# Altium project Dashboard PCB_Project.PrjPcb
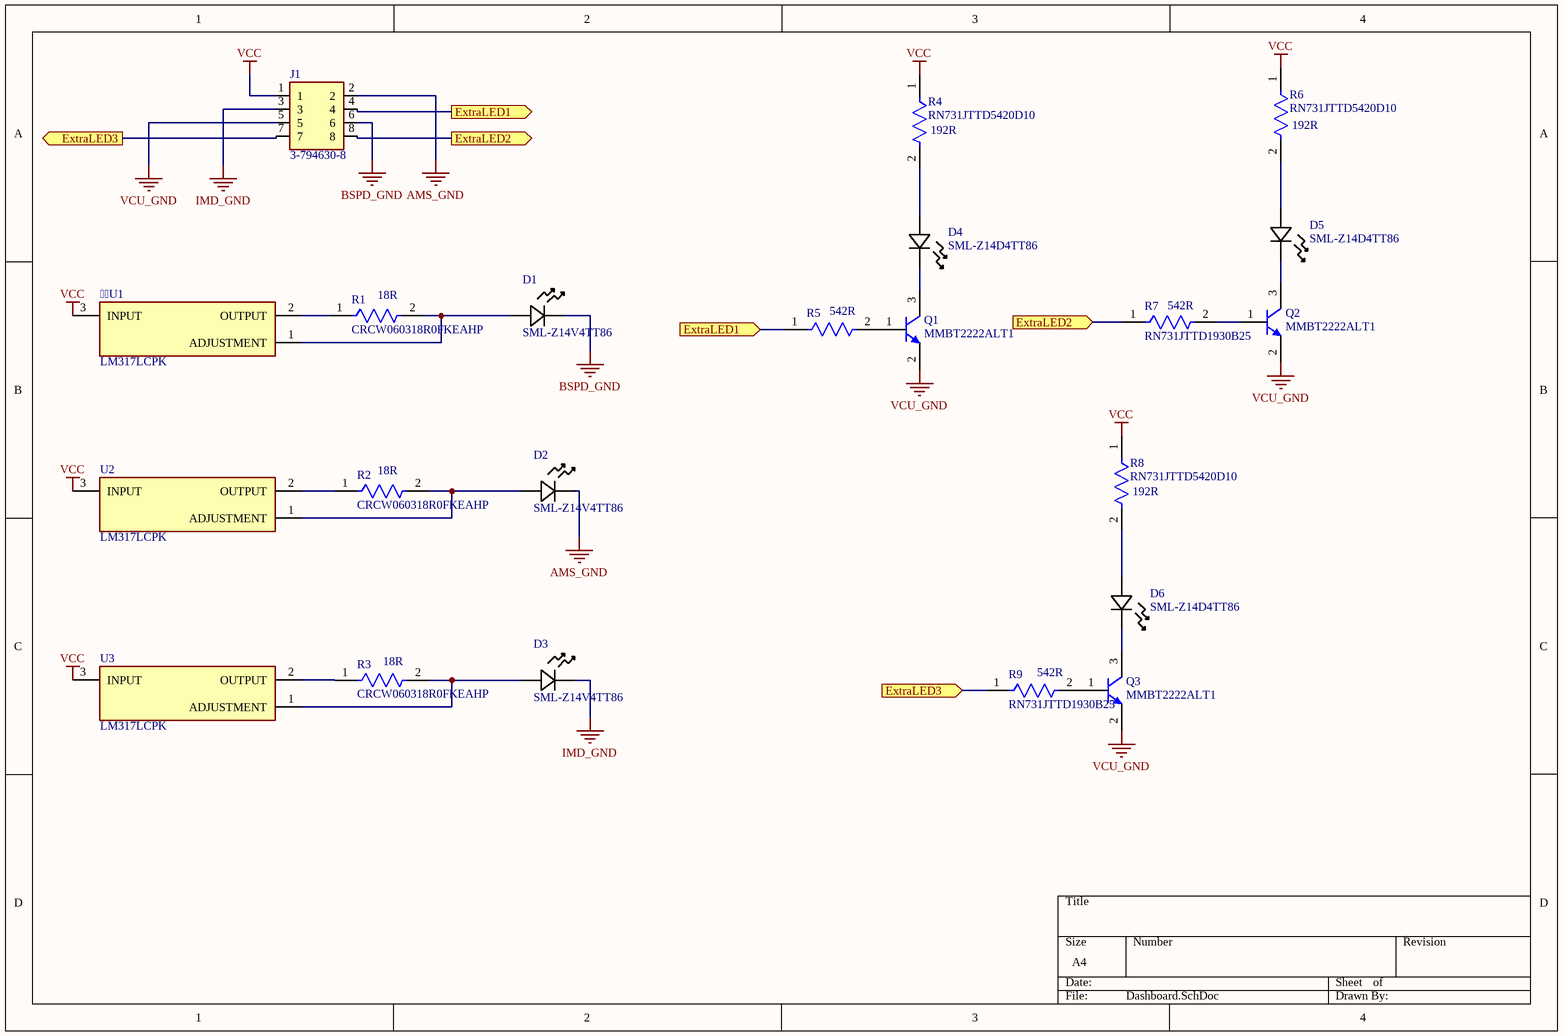
[diagram p0: Dashboard.SchDoc]
1 sheet, 22 parts. Net scope: flat (ports and power ports of the same name join across sheets).
Board file: Dashboard PCB.PcbDoc

## Sheet Dashboard.SchDoc
size A4; SheetNumber: 1; SheetTotal: 1

### Parts
U1  LM317LCPK  [FP-PK0003A-MFG]
D1  SML-Z14V4TT86  [LED_SMLZ14_ROM]
D2  SML-Z14V4TT86  [LED_SMLZ14_ROM]
D3  SML-Z14V4TT86  [LED_SMLZ14_ROM]
D4  SML-Z14D4TT86  [LED_SMLZ14_ROM]
D5  SML-Z14D4TT86  [LED_SMLZ14_ROM]
D6  SML-Z14D4TT86  [LED_SMLZ14_ROM]
J1  3-794630-8  [CONN_3-794630-8]
Q1  MMBT2222ALT1  [ONSC-SOT-23-3-318-08_V]
Q2  MMBT2222ALT1  [ONSC-SOT-23-3-318-08_V]
Q3  MMBT2222ALT1  [ONSC-SOT-23-3-318-08_V]
R1  CRCW060318R0FKEAHP  [FP-CRCW0603-HPe3-IPC_C]
R2  CRCW060318R0FKEAHP  [FP-CRCW0603-HPe3-IPC_C]
R3  CRCW060318R0FKEAHP  [FP-CRCW0603-HPe3-IPC_C]
R4  RN731JTTD5420D10  [FP-RN731J-IPC_A]
R5  RN731JTTD1930B25  [FP-RN731J-IPC_C]  (value not drawn)
R6  RN731JTTD5420D10  [FP-RN731J-IPC_A]
R7  RN731JTTD1930B25  [FP-RN731J-IPC_C]
R8  RN731JTTD5420D10  [FP-RN731J-IPC_A]
R9  RN731JTTD1930B25  [FP-RN731J-IPC_C]
U2  LM317LCPK  [FP-PK0003A-MFG]
U3  LM317LCPK  [FP-PK0003A-MFG]

### Ports
ExtraLED1 (in, see Dashboard[2A]), ExtraLED1 (out, see Dashboard[2B]), ExtraLED2 (in, see Dashboard[2A]), ExtraLED2 (out, see Dashboard[3B]), ExtraLED3 (in, see Dashboard[1A]), ExtraLED3 (out, see Dashboard[3C])

### Nets
AMS_GND: D2.1 J1.2
BSPD_GND: D1.1 J1.6
IMD_GND: D3.1 J1.3
VCC: U1.3(INPUT) J1.1 R4.1 R6.1 R8.1 U2.3(INPUT) U3.3(INPUT)
VCU_GND: J1.5 Q1.2(E) Q2.2(E) Q3.2(E)
NetU1_1: U1.1(ADJUSTMENT) D1.2 R1.2
NetU1_2: U1.2(OUTPUT) R1.1
NetD2_2: D2.2 R2.2 U2.1(ADJUSTMENT)
NetD3_2: D3.2 R3.2 U3.1(ADJUSTMENT)
NetD4_1: D4.1 Q1.3(C)
NetD4_2: D4.2 R4.2
NetD5_1: D5.1 Q2.3(C)
NetD5_2: D5.2 R6.2
NetD6_1: D6.1 Q3.3(C)
NetD6_2: D6.2 R8.2
NetJ1_4: J1.4 R5.1 ; port ExtraLED1
NetJ1_7: J1.7 R9.1 ; port ExtraLED3
NetJ1_8: J1.8 R7.1 ; port ExtraLED2
NetQ1_1: Q1.1(B) R5.2
NetQ2_1: Q2.1(B) R7.2
NetQ3_1: Q3.1(B) R9.2
NetR2_1: R2.1 U2.2(OUTPUT)
NetR3_1: R3.1 U3.2(OUTPUT)

### Notes on the sheet
- (near R4) 192R
- (near R6) 192R
- (near R1) 18R
- (near R5) 542R
- (near R7) 542R
- (near R2) 18R
- (near R8) 192R
- (near R3) 18R
- (near R9) 542R

### Library data of the parts
U1 U2 U3 = CMP-04917-000008-1: IC REG LIN POS ADJ 100MA SOT89-3; Manufacturer: Texas Instruments; Nominal Supply Current: 50uA; Output Type: AdjustableProgrammable; Max Supply Voltage: 35V; Number Of Outputs: 1; Max Junction Temp: +125°C; Accuracy Percentage: 4%; Min Supply Voltage: 5V; Output Voltage: 1.25-32V; Dropout Voltage: 2000mV; Device Class L3: Voltage Regulators - Linear; ComponentLink2Description: Datasheet; Height: 1.6mm; Digikey Description: IC REG LIN POS ADJ 100MA SOT89-3; Device Class L1: Integrated Circuits (ICs); Footprint Url: http://www.ti.com/lit/ml/pptd070/pptd070.pdf; Temperature Range Low: 0°C; Lead Free: Yes; Mouser Description: 3/8 Pin 100mA Adjustable Positive egulator 3-SOT-89 0 to 125; Category: IC; Automotive: No; Device Class L2: Power Management ICs; Temperature Range High: +125°C; Manufacturer Part Number: LM317LCPK; Octopart: https://octopart.com/lm317lcpk-texas+instruments-7099493; RoHS: TRUE; Package: PK0003A; ComponentLink2URL: http://www.ti.com/lit/ds/symlink/lm317l.pdf; Temperature: 0°C to +125°C; Output Current: 100mA
D1-D3 = SML-Z14V4TT86: Red 630nm LED Indication - Discrete 2V 2-PLCC; Mfr_Name: ROHM Semiconductor; Type: DEV; Copyright: Copyright (C) 2022 Ultra Librarian. All rights reserved.; Manufacturer_Part_Number: SML-Z14V4TT86; Digi-Key_Part_Number_1: 846-1046-1-ND; Digi-Key_Part_Number_2: 846-1046-2-ND; Digi-Key_Part_Number_3: 846-1046-6-ND; RefDes: RefDes
D4-D6 = SML-Z14D4TT86: LED ORANGE CLEAR 2PLCC SMD; Mfr_Name: ROHM Semiconductor; Type: DEV; Copyright: Copyright (C) 2022 Ultra Librarian. All rights reserved.; Manufacturer_Part_Number: SML-Z14D4TT86; Digi-Key_Part_Number_1: 846-1041-1-ND; Digi-Key_Part_Number_2: 846-1041-2-ND; Digi-Key_Part_Number_3: 846-1041-6-ND; RefDes: RefDes
J1 = 3-794630-8: Wire-To-Board Connector, Vertical, Micro MATE-N-LOK Series, Through Hole, Header, 8, 3 mm; MF: {'manufacturer': 'TE Connectivity'}; Package: None; Value: *; Price: None; MP: 3-794630-8; Availability: Unavailable
Q1-Q3 = CMP-1048-00593-1: General Purpose Transistor, NPN Silicon, 3-Pin SOT-23, Tape and Reel; Manufacturer: On Semiconductor; fT Min (MHz): 300; IC Continuous (A): 0.6; ComponentLink1Description: Manufacturer URL; PackageDescription: 3-Pin Small Outline Transistor, Body 2.92 x 1.3 mm, Pitch 0.95 mm; PackageReference: SOT-23-3-318-08; Polarity: NPN; Packing: Tape and Reel; RoHS: FALSE; Mounting Technology: Surface Mount; PackageVersion: Rev. AP, 11/2009; DatasheetVersion: Rev. 10; PartNumber: MMBT2222ALT1; ComponentLink3Description: Package Specification; ComponentLink2Description: Datasheet; ComponentLink3URL: http://www.onsemi.cn/pub_link/Collateral/318-08.PDF; ComponentLink1URL: http://www.onsemi.com/; ComponentLink2URL: http://www.onsemi.cn/pub_link/Collateral/MMBT2222LT1-D.PDF
R1-R3 = CMP-02407-009286-1: RES Thick Film, 18Ω, 1%, 0.33W, 100ppm/°C, 0603; Voltage Rating (DC): 75V; Resistance: 18R; Power Rating: 250mW; Composition: Thick Film; Width: 0.033inch; Features: Automotive AEC-Q200; Min Operating Temperature: -55°C; Temperature Coefficient: 100ppm/°C; Package Quantity: 5000; Voltage Rating: 75V; Depth: 0.85mm; Case Code (Metric): 1608; Length: 1.6mm; Case Code (Imperial): 0603; Lead Free: Lead Free; Case/Package: 0603; Height: 0.022inch; Number of Terminations: 2; Tolerance: 1%; Max Operating Temperature: 155°C; Military Standard: Not; Mount: Surface Mount; Termination: Wraparound; Max Power Dissipation: 250mW; Contact Plating: Tin; Packaging: Tape and Reel
R4 R6 R8 = CMP-04015-051464-1: 542Ω ±0.5% 0.063W, 1/16W Chip Resistor 0603 (1608 Metric) Moisture Resistant Thin Film; Resistance: 542R; Voltage Rating: 50V; Power Rating: 63mW; Temperature Coefficient: 10ppm/°C; Composition: Thin Film; Case Code (Imperial): 0603; Min Operating Temperature: -55°C; Height: 0.45mm; Max Operating Temperature: 125°C; Packaging: Tape and Reel; Width: 0.8mm; Termination: SMD/SMT; Length: 1.6mm; Case Code (Metric): 1608; Case/Package: 0603; Weight: 7.1E-05oz; Tolerance: 0.5%
R5 R7 R9 = CMP-04015-086043-1: 193Ω ±0.1% 0.063W, 1/16W Chip Resistor 0603 (1608 Metric) Moisture Resistant Thin Film; Resistance: 193R; Temperature Coefficient: 25ppm/°C; Power Rating: 63mW; Voltage Rating: 50V; Termination: SMD/SMT; Length: 1.6mm; Tolerance: 0.1%; Series: RN73; Case Code (Imperial): 0603; Resistor Type: Thin Film; Height: 0.45mm; Width: 0.8mm; Max Operating Temperature: 125°C; Min Operating Temperature: -55°C; Case/Package: 0603; RoHS Compliant: Yes; Packaging: Tape and Reel; Case Code (Metric): 1608